# Altium schematic sheet Peripheral.SchDoc
size A; SheetNumber: 5; SheetTotal: 5
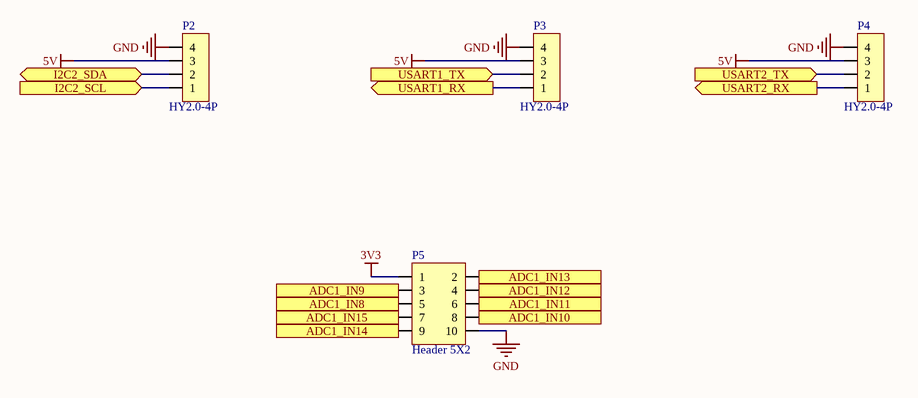
[diagram p0: Peripheral.SchDoc]

## Parts
P2  HY2.0-4P  [HY2.0-4P-RA]
P3  HY2.0-4P  [HY2.0-4P-RA]
P4  HY2.0-4P  [HY2.0-4P-RA]
P5  Header 5X2  [DC3-10P-1.27MM-RA]

## Ports
ADC1_IN8 (out), ADC1_IN9 (out), ADC1_IN10 (out), ADC1_IN11 (out), ADC1_IN12 (out), ADC1_IN13 (out), ADC1_IN14 (out), ADC1_IN15 (out), I2C2_SCL (in), I2C2_SDA (bidir), USART1_RX (out), USART1_TX (in), USART2_RX (out), USART2_TX (in)

## Nets
3V3: P5.1
5V: P2.3 P3.3 P4.3
GND: P2.4 P3.4 P4.4 P5.10
ADC1_IN8: P5.5 ; port ADC1_IN8
ADC1_IN9: P5.3 ; port ADC1_IN9
ADC1_IN10: P5.8 ; port ADC1_IN10
ADC1_IN11: P5.6 ; port ADC1_IN11
ADC1_IN12: P5.4 ; port ADC1_IN12
ADC1_IN13: P5.2 ; port ADC1_IN13
ADC1_IN14: P5.9 ; port ADC1_IN14
ADC1_IN15: P5.7 ; port ADC1_IN15
I2C2_SCL: P2.1 ; port I2C2_SCL
I2C2_SDA: P2.2 ; port I2C2_SDA
USART1_RX: P3.1 ; port USART1_RX
USART1_TX: P3.2 ; port USART1_TX
USART2_RX: P4.1 ; port USART2_RX
USART2_TX: P4.2 ; port USART2_TX

## Library data of the parts
P2-P4 = Header 4: Header, 4-Pin
P5 = Header 5X2: Header, 5-Pin, Dual row; LatestRevisionDate: 17-Jul-2002; LatestRevisionNote: Re-released for DXP Platform.; Publisher: Altium Limited